# EAGLE schematic 36s_Cell_Fixtures (EAGLE 5.12)
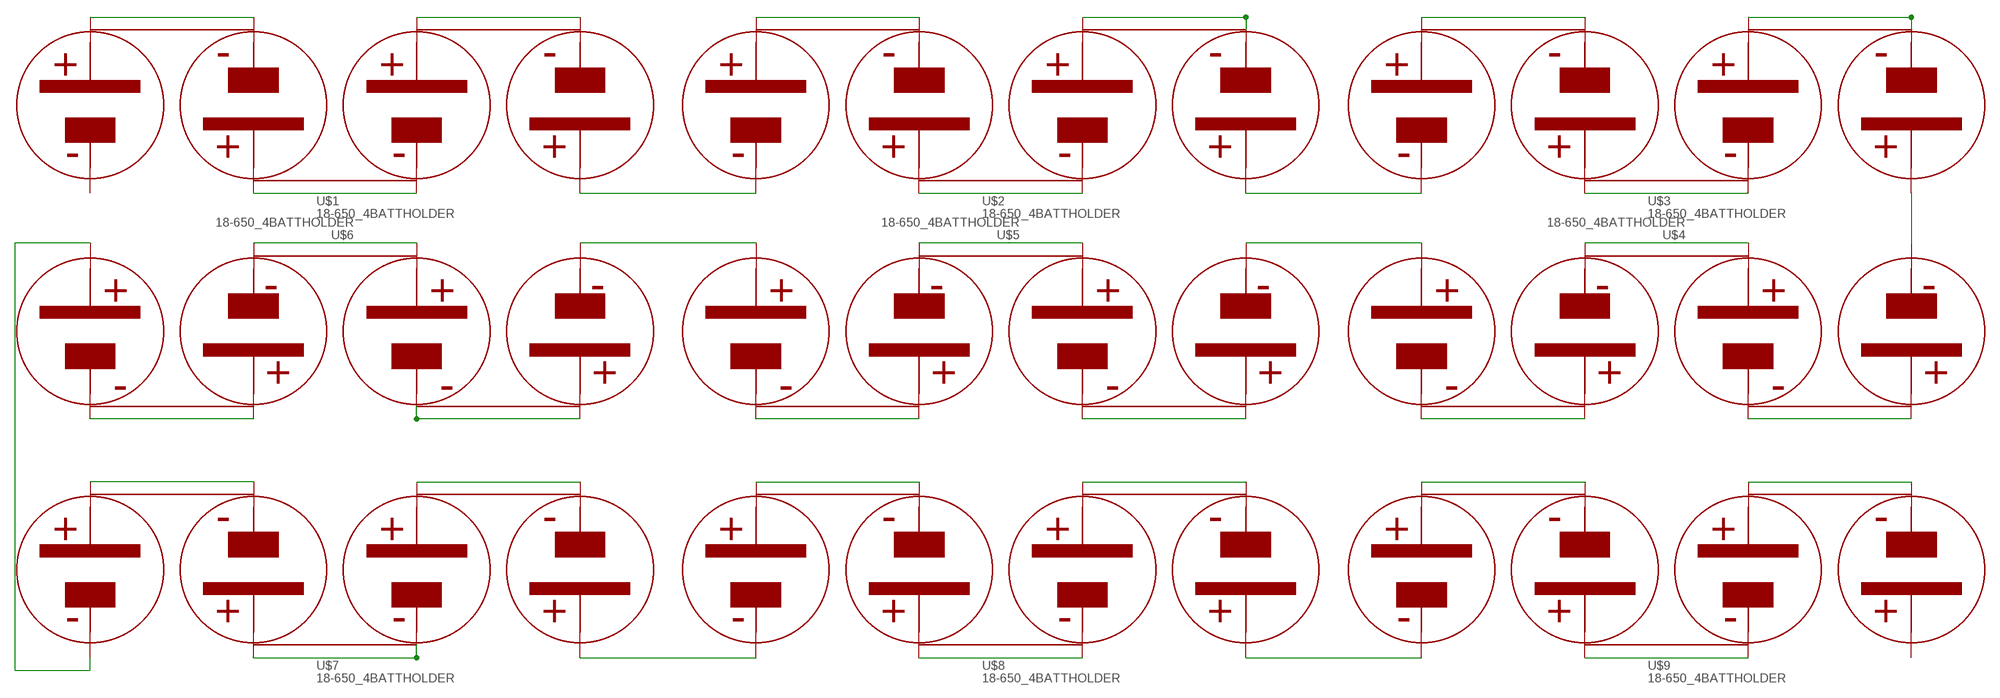
[diagram p0: schematic, sheet 1]

## Parts
U$1  18-650_4BATTHOLDER  [18650-4BATT]
U$2  18-650_4BATTHOLDER  [18650-4BATT]
U$3  18-650_4BATTHOLDER  [18650-4BATT]
U$4  18-650_4BATTHOLDER  [18650-4BATT]
U$5  18-650_4BATTHOLDER  [18650-4BATT]
U$6  18-650_4BATTHOLDER  [18650-4BATT]
U$7  18-650_4BATTHOLDER  [18650-4BATT]
U$8  18-650_4BATTHOLDER  [18650-4BATT]
U$9  18-650_4BATTHOLDER  [18650-4BATT]

## Nets
N$1: U$1.BATT+1 U$1.BATT-2
N$2: U$1.BATT+2 U$1.BATT-3
N$3: U$1.BATT+3 U$1.BATT-4
N$4: U$1.BATT+4 U$2.BATT-1
N$5: U$2.BATT+1 U$2.BATT-2
N$6: U$2.BATT+2 U$2.BATT-3
N$7: U$2.BATT+3 U$2.BATT-4
N$8: U$2.BATT+4 U$3.BATT-1
N$9: U$3.BATT+1 U$3.BATT-2
N$10: U$3.BATT+2 U$3.BATT-3
N$11: U$3.BATT+3 U$3.BATT-4
N$12: U$3.BATT+4 U$4.BATT-1
N$13: U$4.BATT+1 U$4.BATT-2
N$14: U$4.BATT+2 U$4.BATT-3
N$15: U$4.BATT+3 U$4.BATT-4
N$16: U$4.BATT+4 U$5.BATT-1
N$17: U$5.BATT+1 U$5.BATT-2
N$18: U$5.BATT+2 U$5.BATT-3
N$19: U$5.BATT+3 U$5.BATT-4
N$20: U$5.BATT+4 U$6.BATT-1
N$21: U$6.BATT+1 U$6.BATT-2
N$22: U$6.BATT+2 U$6.BATT-3
N$23: U$6.BATT+3 U$6.BATT-4
N$24: U$6.BATT+4 U$7.BATT-1
N$25: U$7.BATT+1 U$7.BATT-2
N$26: U$7.BATT+2 U$7.BATT-3
N$27: U$7.BATT+3 U$7.BATT-4
N$28: U$7.BATT+4 U$8.BATT-1
N$29: U$8.BATT+1 U$8.BATT-2
N$30: U$8.BATT+2 U$8.BATT-3
N$31: U$8.BATT+3 U$8.BATT-4
N$32: U$8.BATT+4 U$9.BATT-1
N$33: U$9.BATT+1 U$9.BATT-2
N$34: U$9.BATT+2 U$9.BATT-3
N$35: U$9.BATT+3 U$9.BATT-4
Unconnected: U$1.BATT-1 U$9.BATT+4

## Library data of the parts
U$1-U$9 = MPD:18-650_4BATTHOLDER: Datasheet: http://www.memoryprotectiondevices.com/datasheets/BK-18650-PC8-datasheet.pdf Used in 18-650 cell fixtures 12/3/14; PARTNO: BK-18650-PC8